# Altium project CMS015.PrjPCB
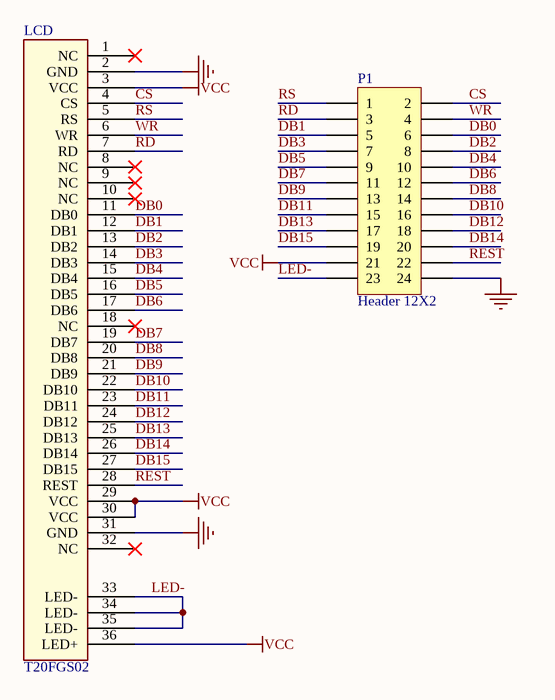
[diagram p0: CMS015.SchDoc]
1 sheet, 2 parts. Net scope: global (net labels, ports and power ports of the same name join across sheets).
Board file: CMS015.PcbDoc

## Sheet CMS015.SchDoc
size A4

### Parts
LCD  T20FGS02  [LCD_T20FGS02]
P1  Header 12X2  [HDR2X12]

### Nets
GND: LCD.2(GND) LCD.31(GND) P1.24
VCC: LCD.3(VCC) LCD.29(VCC) LCD.30(VCC) LCD.36(LED+) P1.21
CS: LCD.4(CS) P1.2
DB0: LCD.11(DB0) P1.6
DB1: LCD.12(DB1) P1.5
DB2: LCD.13(DB2) P1.8
DB3: LCD.14(DB3) P1.7
DB4: LCD.15(DB4) P1.10
DB5: LCD.16(DB5) P1.9
DB6: LCD.17(DB6) P1.12
DB7: LCD.19(DB7) P1.11
DB8: LCD.20(DB8) P1.14
DB9: LCD.21(DB9) P1.13
DB10: LCD.22(DB10) P1.16
DB11: LCD.23(DB11) P1.15
DB12: LCD.24(DB12) P1.18
DB13: LCD.25(DB13) P1.17
DB14: LCD.26(DB14) P1.20
DB15: LCD.27(DB15) P1.19
LED-: LCD.33(LED-) LCD.34(LED-) LCD.35(LED-) P1.23
RD: LCD.7(RD) P1.3
REST: LCD.28(REST) P1.22
RS: LCD.5(RS) P1.1
WR: LCD.6(WR) P1.4

Not connected (* = marked no-connect by the designer): LCD 1(NC)* 8(NC)* 9(NC)* 10(NC)* 18(NC)* 32(NC)*

### Library data of the parts
LCD = LCD_T20FGS02
P1 = Header 12X2: Header, 12-Pin, Dual row; LatestRevisionDate: 17-Jul-2002; LatestRevisionNote: Re-released for DXP Platform.; Publisher: Altium Limited